# EAGLE design UCENGSOC_BadgeCore (EAGLE 9.6.2)
CNAME: UC ENG SOC Badge Core; CREVISION: 1.0; DESIGNER: Jed Hodson - Scatter Labs Pty Ltd

## Sheet 1 of 2: MCU Core
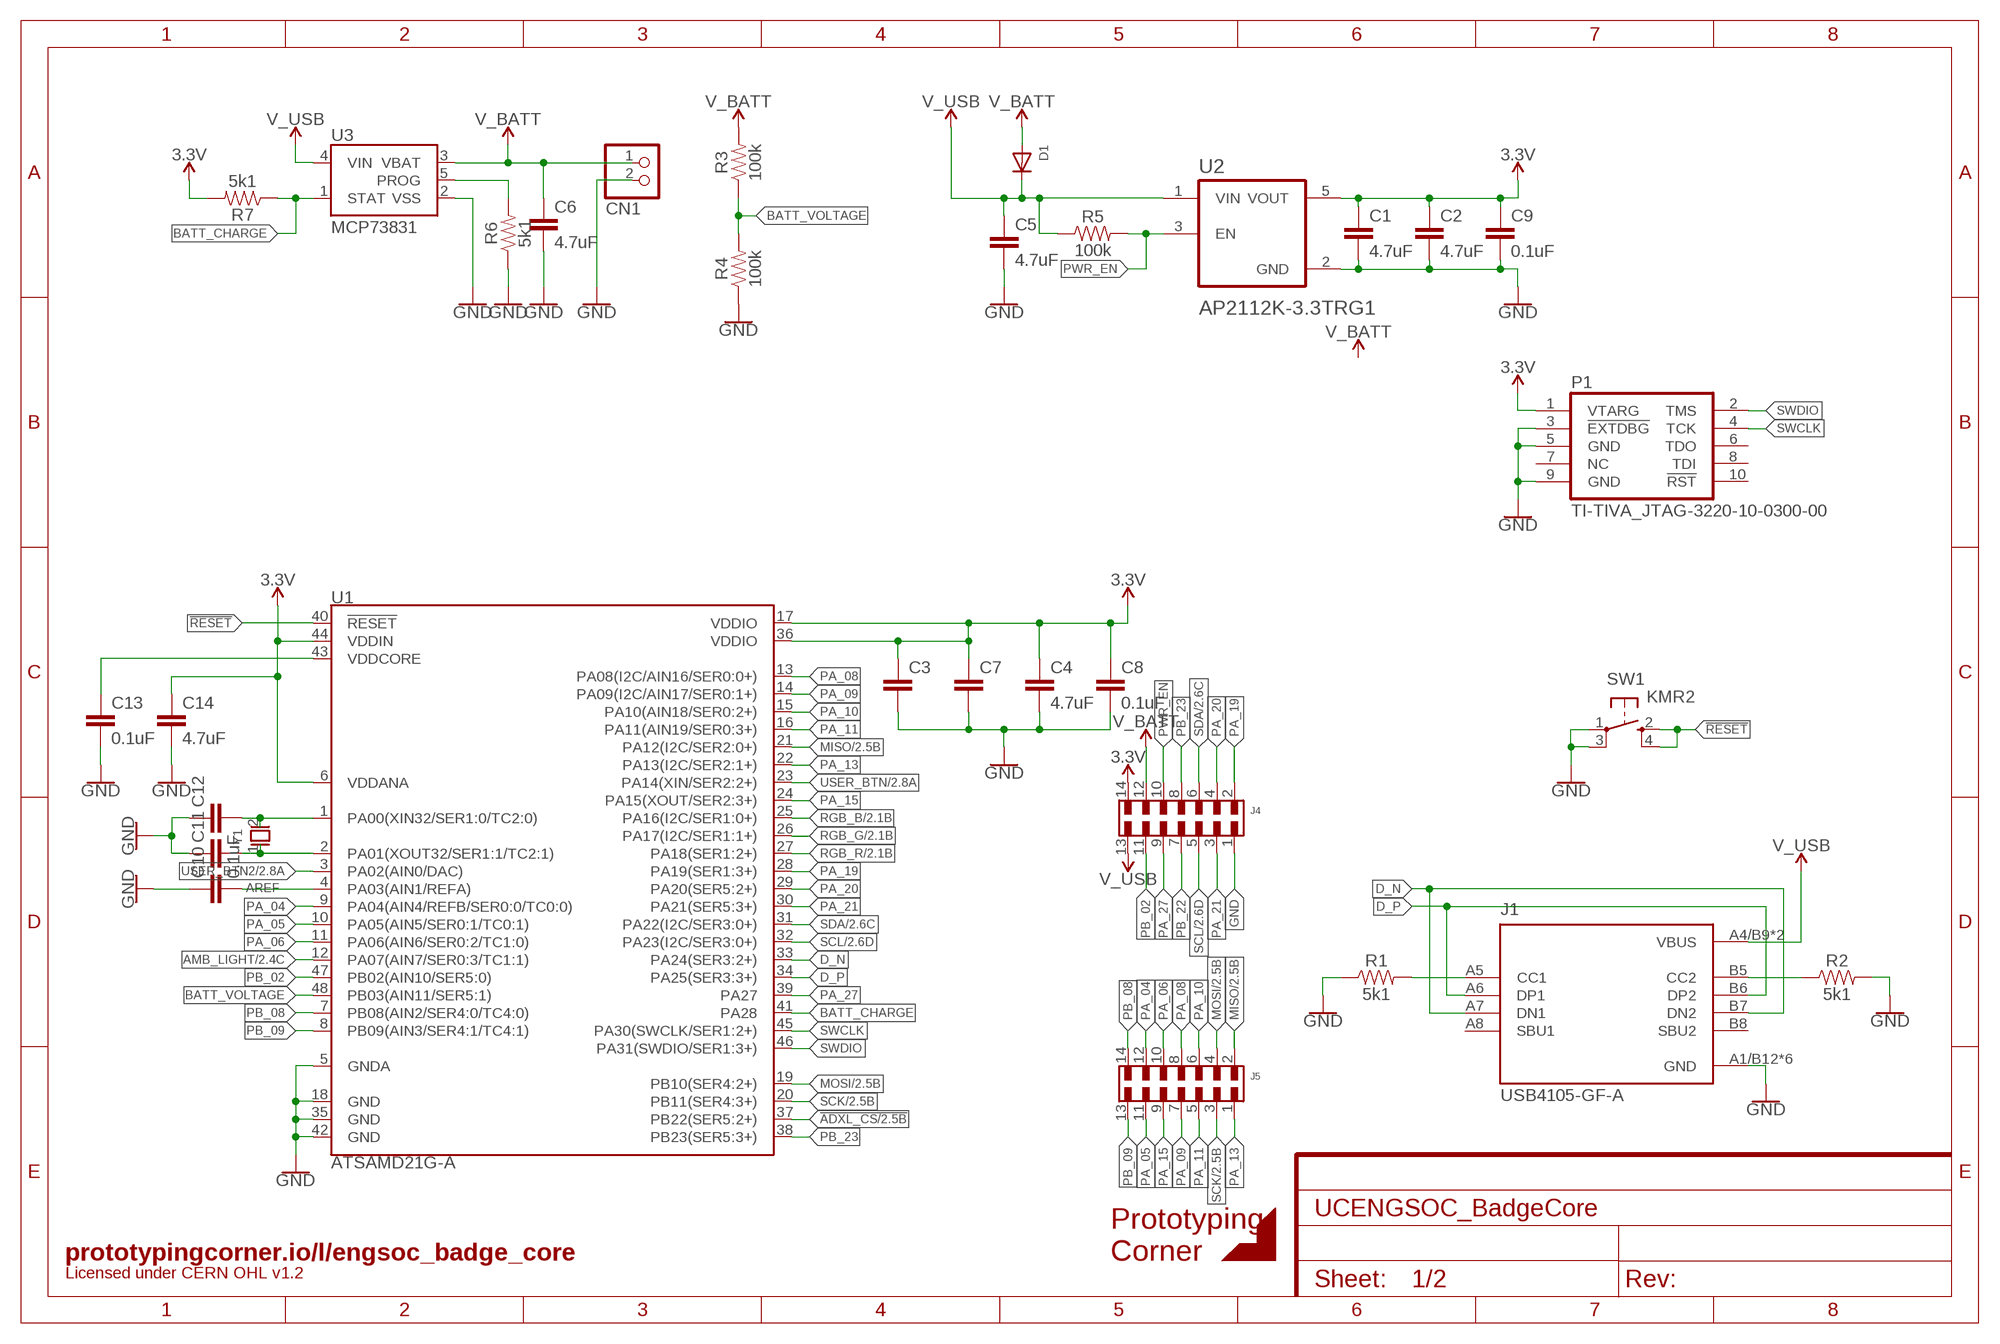
[diagram p0: schematic, sheet 1]

### Parts
C1  4.7uF  4.7UF-1206-16V-(+80/-20%)  [1206]
C2  4.7uF  4.7UF-1206-16V-(+80/-20%)  [1206]
C3  4.7UF-1206-16V-(+80/-20%)  [1206]
C4  4.7uF  4.7UF-1206-16V-(+80/-20%)  [1206]
C5  4.7uF  4.7UF-1206-16V-(+80/-20%)  [1206]
C6  4.7uF  4.7UF-1206-16V-(+80/-20%)  [1206]
C7  0.1UF-0603-25V-5%  [0603]
C8  0.1uF  0.1UF-0603-25V-5%  [0603]
C9  0.1uF  0.1UF-0603-25V-5%  [0603]
C10  0.1uF  0.1UF-0603-25V-5%  [0603]
C11  15PF-0603-50V-5%  [0603]
C12  15PF-0603-50V-5%  [0603]
C13  0.1uF  0.1UF-0603-25V-5%  [0603]
C14  4.7uF  4.7UF-1206-16V-(+80/-20%)  [1206]
CN1  JST_2PIN-SMT-RA  [JST-PH-2-SMT-RA]
D1  DIODE_SOD-123FL  [SOD-123FL]
J1  USB4105-GF-A  [GCT_USB4105-GF-A]
J4  6100XX21121_61001421121  [61001421121]
J5  6100XX21121_61001421121  [61001421121]
P1  TI-TIVA_JTAG-3220-10-0300-00  [TI-TIVA_3220-10-0300-00]
R1  5k1  RESISTOR0603  [0603]
R2  5k1  RESISTOR0603  [0603]
R3  100k  RESISTOR0603  [0603]
R4  100k  RESISTOR0603  [0603]
R5  100k  RESISTOR0603  [0603]
R6  5k1  RESISTOR0603  [0603]
R7  5k1  RESISTOR0603  [0603]
SW1  KMR2  SPST_TACT-KMR2  [KMR2]
U1  ATSAMD21G-A  [TQFP-48]
U2  AP2112K-3.3TRG1  [SOT95P285X140-5N]
U3  MCP73831  [SOT23-5]
U$1  LOGOSMALL_COPPER  [LOGO_SMALL_COPPER]
Y1  FC-135_32.7680KA-A0  [XTAL_FC-135_32.7680KA-A0]

### Nets
3.3V: C1.1 C2.1 C3.1 C4.1 C7.1 C8.1 C9.1 C14.1 J4.14 P1.1(VTARG) R7.2 U1.6(VDDANA) U1.17(VDDIO) U1.36(VDDIO) U1.44(VDDIN) U2.5(VOUT) ; also sheet 2
!ADXL_CS: U1.37(PB22(SER5:2+)) ; also sheet 2
!RESET: SW1.2(S) SW1.4(S1) U1.40(!RESET!)
AMB_LIGHT: U1.12(PA07(AIN7/SER0:3/TC1:1)) ; also sheet 2
AREF: C10.2 U1.4(PA03(AIN1/REFA))
BATT_CHARGE: R7.1 U1.41(PA28) U3.1(STAT)
BATT_VOLTAGE: R3.1 R4.2 U1.48(PB03(AIN11/SER5:1))
D_N: J1.A7(DN1) J1.B7(DN2) U1.33(PA24(SER3:2+))
D_P: J1.A6(DP1) J1.B6(DP2) U1.34(PA25(SER3:3+))
GND: C1.2 C2.2 C3.2 C4.2 C5.2 C6.2 C7.2 C8.2 C9.2 C10.1 C11.1 C12.1 C13.2 C14.2 CN1.2 J1.A1/B12(GND) J1.B1/A12(GND) J1.G1(GND) J1.G2(GND) J1.G3(GND) J1.G4(GND) J4.1 P1.3(!EXTDBG!) P1.5(GND) P1.9(GND) R1.1 R2.2 R4.1 R6.1 SW1.1(P) SW1.3(P1) U1.5(GNDA) U1.18(GND) U1.35(GND) U1.42(GND) U2.2(GND) U3.2(VSS) ; also sheet 2
MISO: J5.2 U1.21(PA12(I2C/SER2:0+)) ; also sheet 2
MOSI: J5.4 U1.19(PB10(SER4:2+)) ; also sheet 2
N$1: R6.2 U3.5(PROG)
N$2: C13.1 U1.43(VDDCORE)
N$4: C12.2 U1.1(PA00(XIN32/SER1:0/TC2:0)) Y1.2
N$5: C11.2 U1.2(PA01(XOUT32/SER1:1/TC2:1)) Y1.1
N$31: J1.A5(CC1) R1.2
N$34: J1.B5(CC2) R2.1
PA_04: J5.12 U1.9(PA04(AIN4/REFB/SER0:0/TC0:0))
PA_05: J5.11 U1.10(PA05(AIN5/SER0:1/TC0:1))
PA_06: J5.10 U1.11(PA06(AIN6/SER0:2/TC1:0))
PA_08: J5.8 U1.13(PA08(I2C/AIN16/SER0:0+))
PA_09: J5.7 U1.14(PA09(I2C/AIN17/SER0:1+))
PA_10: J5.6 U1.15(PA10(AIN18/SER0:2+))
PA_11: J5.5 U1.16(PA11(AIN19/SER0:3+))
PA_13: J5.1 U1.22(PA13(I2C/SER2:1+))
PA_15: J5.9 U1.24(PA15(XOUT/SER2:3+))
PA_19: J4.2 U1.28(PA19(SER1:3+))
PA_20: J4.4 U1.29(PA20(SER5:2+))
PA_21: J4.3 U1.30(PA21(SER5:3+))
PA_27: J4.9 U1.39(PA27)
PB_02: J4.11 U1.47(PB02(AIN10/SER5:0))
PB_08: J5.14 U1.7(PB08(AIN2/SER4:0/TC4:0))
PB_09: J5.13 U1.8(PB09(AIN3/SER4:1/TC4:1))
PB_22: J4.7
PB_23: J4.8 U1.38(PB23(SER5:3+))
PWR_EN: J4.10 R5.2 U2.3(EN)
RGB_B: U1.25(PA16(I2C/SER1:0+)) ; also sheet 2
RGB_G: U1.26(PA17(I2C/SER1:1+)) ; also sheet 2
RGB_R: U1.27(PA18(SER1:2+)) ; also sheet 2
SCK: J5.3 U1.20(PB11(SER4:3+)) ; also sheet 2
SCL: J4.5 U1.32(PA23(I2C/SER3:0+)) ; also sheet 2
SDA: J4.6 U1.31(PA22(I2C/SER3:0+)) ; also sheet 2
SWCLK: P1.4(TCK) U1.45(PA30(SWCLK/SER1:2+))
SWDIO: P1.2(TMS) U1.46(PA31(SWDIO/SER1:3+))
USER_BTN: U1.23(PA14(XIN/SER2:2+)) ; also sheet 2
USER_BTN2: U1.3(PA02(AIN0/DAC)) ; also sheet 2
V_BATT: C6.1 CN1.1 D1.A J4.12 R3.2 U3.3(VBAT)
V_USB: C5.1 D1.C J1.A4/B9(VBUS) J1.B4/A9(VBUS) J4.13 R5.1 U2.1(VIN) U3.4(VIN)
Unconnected: J1.A8(SBU1) J1.B8(SBU2) P1.6(TDO) P1.7(NC) P1.8(TDI) P1.10(!RST!)

### Notes on the sheet
- prototypingcorner.io/l/engsoc_badge_core
- Licensed under CERN OHL v1.2

## Sheet 2 of 2: Peripherals
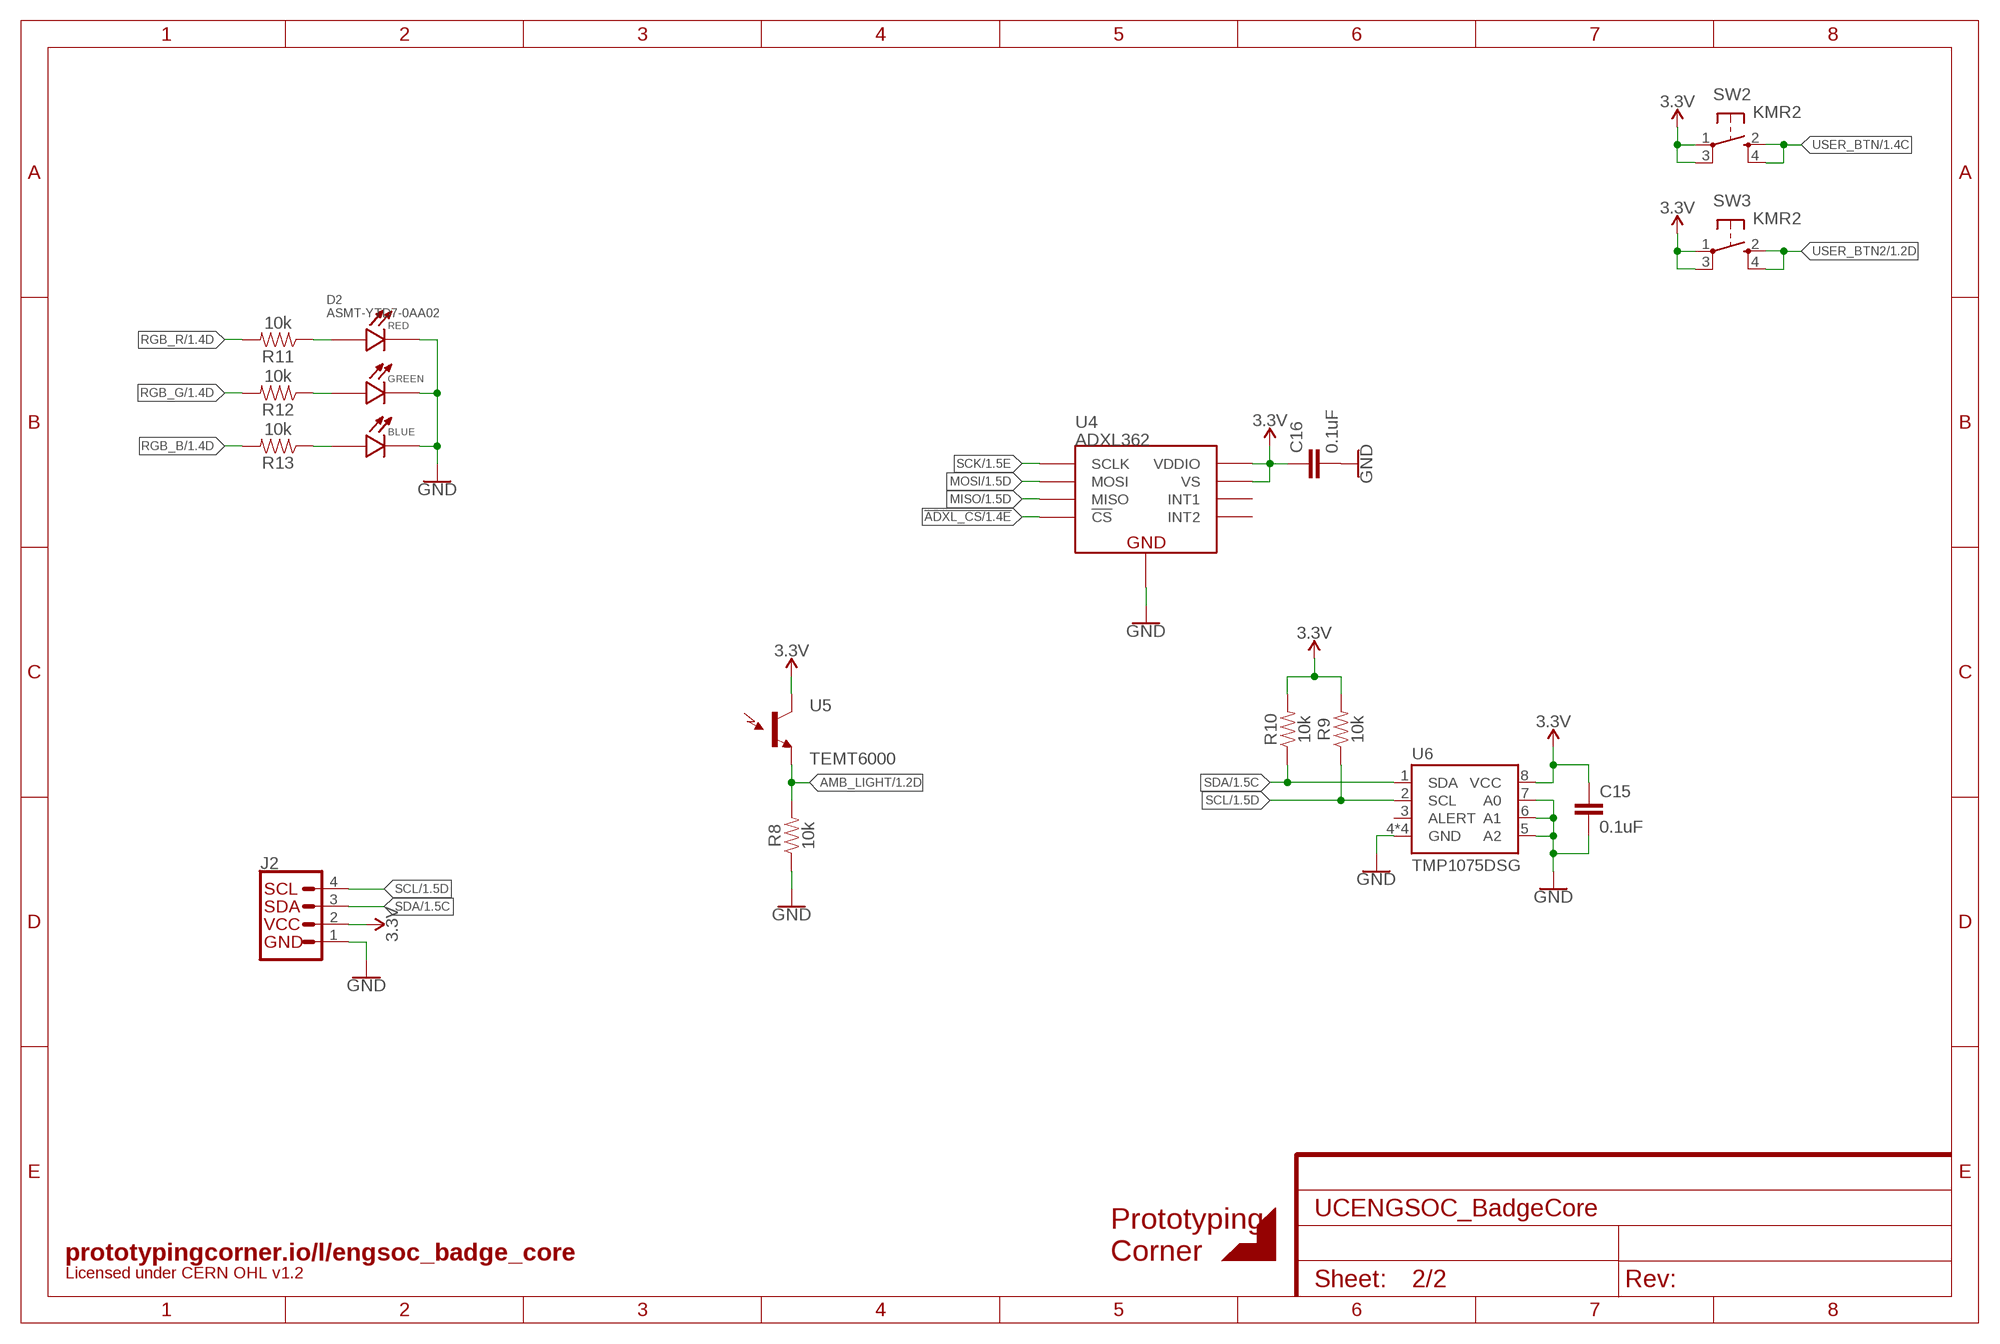
[diagram p1: schematic, sheet 2]

### Parts
C15  0.1uF  0.1UF-0603-25V-(+80/-20%)  [0603]
C16  0.1uF  0.1UF-0603-25V-(+80/-20%)  [0603]
D2  ASMT-YTD7-0AA02  [LED_ASMT-YTD7-0AA02]
J2  QWIIC_CONNECTORJS-1MM  [1X04_1MM_RA]
R8  10k  10KOHM-0603-1/10W-1%  [0603]
R9  10k  10KOHM-0603-1/10W-1%  [0603]
R10  10k  10KOHM-0603-1/10W-1%  [0603]
R11  10k  10KOHM-0603-1/10W-1%  [0603]
R12  10k  10KOHM-0603-1/10W-1%  [0603]
R13  10k  10KOHM-0603-1/10W-1%  [0603]
SW2  KMR2  SPST_TACT-KMR2  [KMR2]
SW3  KMR2  SPST_TACT-KMR2  [KMR2]
U4  ADXL362  [ADXL362]
U5  TEMT6000  [TEMT6000-SEN]
U6  TMP1075DSG  [WSON8]
U$2  LOGOSMALL_COPPER  [LOGO_SMALL_COPPER]

### Nets
3.3V: C15.1 C16.1 J2.2(VCC) R9.2 R10.2 SW2.1(P) SW2.3(P1) SW3.1(P) SW3.3(P1) U4.P$1(VDDIO) U4.P$14(VS) U5.COLLECTOR(C1) U6.8(VCC) ; also sheet 1
!ADXL_CS: U4.P$8(!CS) ; also sheet 1
AMB_LIGHT: R8.2 U5.EMITTER(E1) ; also sheet 1
GND: C15.2 C16.2 D2.1(B_C) D2.2(G_C) D2.3(R_C) J2.1(GND) R8.1 U4.P$12(GND) U4.P$13(GND) U4.P$16(GND) U6.4(GND) U6.5(A2) U6.6(A1) U6.7(A0) U6.9(GND) U6.10(GND) U6.11(GND) ; also sheet 1
MISO: U4.P$7(MISO) ; also sheet 1
MOSI: U4.P$6(MOSI) ; also sheet 1
N$11: D2.6(B_A) R13.1
N$12: D2.5(G_A) R12.1
N$13: D2.4(R_A) R11.1
RGB_B: R13.2 ; also sheet 1
RGB_G: R12.2 ; also sheet 1
RGB_R: R11.2 ; also sheet 1
SCK: U4.P$4(SCLK) ; also sheet 1
SCL: J2.4(SCL) R9.1 U6.2(SCL) ; also sheet 1
SDA: J2.3(SDA) R10.1 U6.1(SDA) ; also sheet 1
USER_BTN: SW2.2(S) SW2.4(S1) ; also sheet 1
USER_BTN2: SW3.2(S) SW3.4(S1) ; also sheet 1
Unconnected: U4.P$9(INT2) U4.P$11(INT1) U6.3(ALERT)

### Notes on the sheet
- prototypingcorner.io/l/engsoc_badge_core
- Licensed under CERN OHL v1.2

## Library data of the parts
C1 C2 C4-C6 C14 = SparkFun-Capacitors:4.7UF: 4.7µF ceramic capacitors A capacitor is a passive two-terminal electrical component used to store electrical energy temporarily in an electric field.; PROD_ID: CAP-10300
C3 = SparkFun-Capacitors:4.7UF: 4.7µF ceramic capacitors A capacitor is a passive two-terminal electrical component used to store electrical energy temporarily in an electric field.; PROD_ID: CAP-10300; VALUE: 4.7uF
C7 = SparkFun-Capacitors:0.1UF: 0.1µF ceramic capacitors A capacitor is a passive two-terminal electrical component used to store electrical energy temporarily in an electric field.; PROD_ID: CAP-08604; VALUE: 0.1uF
C8-C10 C13 = SparkFun-Capacitors:0.1UF: 0.1µF ceramic capacitors A capacitor is a passive two-terminal electrical component used to store electrical energy temporarily in an electric field.; PROD_ID: CAP-08604
C11 C12 = SparkFun-Capacitors:15PF: 15pF ceramic capacitors A capacitor is a passive two-terminal electrical component used to store electrical energy temporarily in an electric field.; PROD_ID: CAP-07881; VALUE: 15pF
C15 C16 = SparkFun-Capacitors:0.1UF: 0.1µF ceramic capacitors A capacitor is a passive two-terminal electrical component used to store electrical energy temporarily in an electric field.; PROD_ID: CAP-00810
CN1 = adafruit:JST_2PIN: JST 2-Pin Connectors of various flavors SMT-RA (S2B-PH-SM4) 4UConnector #17311 SMT (B2B-PH-SM4) THM-RA (S2B-PH) THM (B2B-PH)
D1 = adafruit:DIODE: Diode SMADIODE - SMA Surface Mount Package 20V 1A Schottky Diode Digikey: 641-1014-6-ND DO-1N4148 - Through Hole Small Current Diode SOD-123 20V 1 A (.5mV Vf) Schottky Diode - Digikey: MBRX120TPMSCT-ND SOD-323 10V 570mA (.38mV Vf, 3ns) Schottky Diode - Digikey: ZLLS410CT-ND SOD-523 30V 30mA Schottky Diode (RB751S-40TE61) - Digikey: RB751S-40TE61CT-ND SOT23-R/W - SOT23 Package (R = Solder Paste/Reflow Ovens, W = Hand-Soldering) BAT54Film 40V 300mA - Digikey: 497-7162-1-ND
D2 = ASMT-YTD7-0AA02:ASMT-YTD7-0AA02: SMD LED RGB 1.8...3.6 V PLCC-6 | Broadcom ASMTYTD70AA02 @ LED, SMD (SMD LED RGB 1.8...3.6 V PLCC-6 LEDs – SMD).; AVAILABILITY: Unavailable; DESCRIPTION: Red, Green, Blue _RGB_ 623nm Red, 529nm Green, 469nm Blue LED Indication - Discrete 2.1V Red, 3.1V Green, 3.1V Blue 6-SMD, J-Lead; MF: Broadcom Limited; MP: ASMT-YTD7-0AA02; PACKAGE: PLCC-6 Broadcom; PRICE: None
J1 = USB4105-GF-A:USB4105-GF-A: USB Type C Receptacle for USB 2.0 SMT Type, PCB Top Mount; AVAILABILITY: Unavailable; DESCRIPTION: USB-C _USB TYPE-C_ USB 2.0 Receptacle Connector 24 _16+8 Dummy_ Position Surface Mount, Right Angle; Through Hole; MF: GCT; MP: USB4105-GF-A; PACKAGE: None; PRICE: None
J2 = SparkFun-Connectors:QWIIC_CONNECTOR: SparkFun I2C Standard Qwiic Connector An SMD 1mm pitch JST connector makes it easy and quick (get it? Qwiic?) to connect I2C devices to each other. The Qwiic system <http://www.sparkfun.com/qwiic> enables fast and solderless connection between popular platforms and various sensors and actuators. We carry 200mm <https://www.sparkfun.com/products/14204>, 100mm <https://www.sparkfun.com/products/14205>, 50mm <https://www.sparkfun.com/products/14206>, and breadboard friendly <https://www.sparkfun.com/products/14207> Qwiic cables. We also offer 10 pcs strips <https://www.sparkfun.com/products/14323> the SMD connectors.
J4 J5 = Wurth_Connectors_WR-PHD:6100XX21121_61001421121: WR-PHD 2.54 mm SMT Dual Pin Header ARTICLE PROPERTIES: Pins:4;​ 6;​ 8;​ 10;​ 12;​ 14;​ 16;​ 20;​ 22;​ 24;​ 26;​ 32;​ 34;​ 36 KIND PROPERTIES: Pitch：2.54 mm Quality Class:3 as per CECC 75 301-802 Rows：Dual Gender：Pin Header Type：Straight MATERIAL PROPERTIES: Insulator Material :PA6T Insulator Flammability Rating:UL94 V-0 Contact Material:Copper Alloy Contact Plating:Gold Contact Type:Stamped GENERAL INFORMATION Operating Temperature:-40 up to +125 °C Compliance:Lead free / RoHS ELECTRICAL PROPERTIES: Rated Current:3 A IR 1:3 A Withstanding Voltage:500 V (AC) Contact Resistance:20 mΩ RISO:1000 MΩ CERTIFICATION UL Approval:E323964 PACKAGING PROPERTIES Packaging:Tube Details see: https://katalog.we-online.com/en/em/PHD_2_54_SMT_DUAL_PIN_HEADER_6100XX21121 Updated by Yingchun,Shan 2019-10-18 2019 (C) Würth Elektronik; DATASHEET-URL: https://katalog.we-online.com/em/datasheet/61001421121.pdf; GENDER: Pin Header; IR: 3A; MATES: WR-PHD 2.54mm Angled DualSocket Header/Dual Socket Header/Dual Socket Header Bottom Entry/Dual Socket Header Bottom Entry Large/SMT Dual Socket Header/SMT Dual Socket Header Bottom Entry; PACKAGING: Tube; PART-NUMBER: 61001421121; PINS: 14; ROWS: Dual; TYPE: Straight
P1 = LinkedLibrary52101:TI-TIVA_JTAG-: JTAG HEADER 10-PIN
R1-R7 = SparkFun-Resistors:RESISTOR: Generic Resistor Package
R8-R13 = SparkFun-Resistors:10KOHM: 10kΩ resistor A resistor is a passive two-terminal electrical component that implements electrical resistance as a circuit element. Resistors act to reduce current flow, and, at the same time, act to lower voltage levels within circuits. - Wikipedia; PROD_ID: RES-00824
SW1-SW3 = adafruit:SPST_TACT: SMT 6mm switch, EVQQ2 series http://www.ladyada.net/library/eagle
U1 = SparkFun-IC-Microcontroller:ATSAMD21G: Atmel SAMD21G SMART ARM-Based Microcontroller The Atmel ® | SMART ™ SAM D21 is a series of low-power microcontrollers using the 32-bit ARM ® Cortex ® -M0+ processor, and ranging from 32- to 64-pins with up to 256KB Flash and 32KB of SRAM. The SAM D21 devices operate at a maximum frequency of 48MHz and reach 2.46 CoreMark/MHz. They are designed for simple and intuitive migration with identical peripheral modules, hex compatible code, identical linear address map and pin compatible migration paths between all devices in the product series. All devices include intelligent and flexible peripherals, Atmel Event System for inter-peripheral signaling, and support for capacitive touch button, slider and wheel user interfaces. Datasheet SparkFun Products SparkFun SAMD21 Mini Breakout (DEV-13664) SparkFun SAMD21 Dev Breakout (DEV-13672); PROD_ID: IC-13064
U2 = AP2112K-3.3TRG1:AP2112K-3.3TRG1: AP2112 Series 0.6 A 3.3 V Fixed Output SMT LDO Linear Regulator - SOT23-5; DESCRIPTION: AP2112 Series 0.6 A 3.3 V Fixed Output SMT LDO Linear Regulator - SOT23-5; DIGI-KEY_PART_NUMBER: AP2112K-3.3TRG1DICT-ND; DIGI-KEY_PURCHASE_URL: https://www.digikey.com.au/product-detail/en/diodes-incorporated/AP2112K-3.3TRG1/AP2112K-3.3TRG1DICT-ND/4505257?utm_source=snapeda&utm_medium=aggregator&utm_campaign=symbol; MF: Diodes Inc.; MP: AP2112K-3.3TRG1; PACKAGE: SOT-753 Diodes Inc.
U3 = SparkFun-IC-Power:MCP73831: MCP73831T Li-Ion, Li-Pol Controller Miniature single cell, fully integrated Li-Ion, Li-polymer charge management controller Datasheet <http://ww1.microchip.com/downloads/en/DeviceDoc/20001984g.pdf> SparkFun Products: SparkFun ESP32 Thing <https://www.sparkfun.com/products/13907> SparkFun 9DoF Razor IMU M0 <https://www.sparkfun.com/products/14001>; PROD_ID: IC-09995
U4 = SparkFun-Sensors:ADXL362: Micropower 3-axis accelerometer 2/4/8g digital output (SPI)
U5 = SparkFun:TEMT6000: Ambient Light Sensor Simple light detection sensor. Output varies with light intensity input. Spark Fun Electronics SKU : COM-08348
U6 = SecureBits_Electronics:TMP1075: TMP1075 Temperature Sensor With I 2C and SMBus Interface The TMP1075 is the most accurate and lowest power replacement to the industry standard LM75 and TMP75 digital temperature sensors. Available in SOIC-8 and VSSOP-8 packages, the TMP1075 offers pin-to-pin and software compatibility to quickly upgrade any existing xx75 design. An additional new package with the TMP1075 is 2x2 mm DFN reducing the PCB footprint by 79% compared to an SOIC package. Datasheet: https://www.ti.com/lit/ds/symlink/tmp1075.pdf?ts=1609996801486&ref_url=https%253A%252F%252Fwww.ti.com%252Fproduct%252FTMP1075
U$1 U$2 = PrototypingCorner-EagleLib:LOGO: Prototyping Corner Logos
Y1 = FC-135_32.7680KA-A0:FC-135_32.7680KA-A0: None; DESCRIPTION: 32.7680 Khz 20ppm 12.5pf; DIGI-KEY_PART_NUMBER: SER4077CT-ND; DIGI-KEY_PURCHASE_URL: https://www.digikey.com.au/product-detail/en/epson/FC-135-32.7680KA-A0/SER4077CT-ND/5604233?utm_source=snapeda&utm_medium=aggregator&utm_campaign=symbol; MF: EPSON; MP: FC-135 32.7680KA-A0; PACKAGE: SMD-2 Epson

## Board
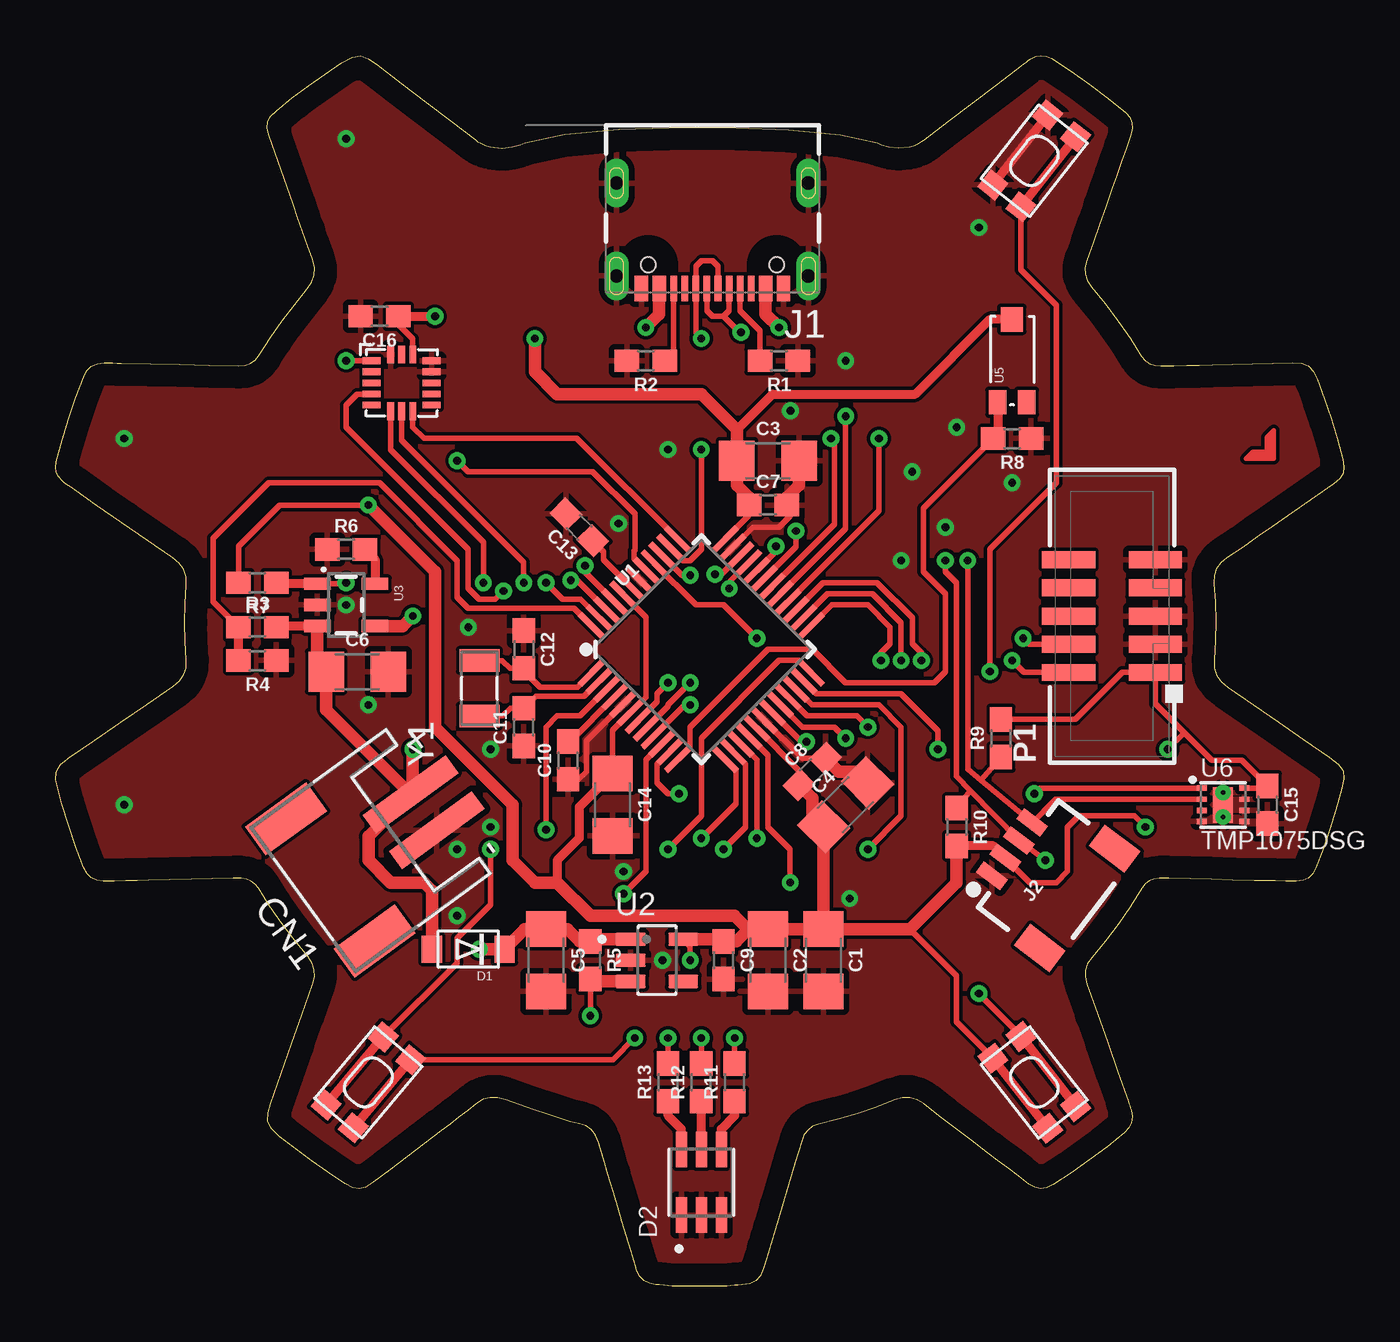
[diagram p2: board, top side]
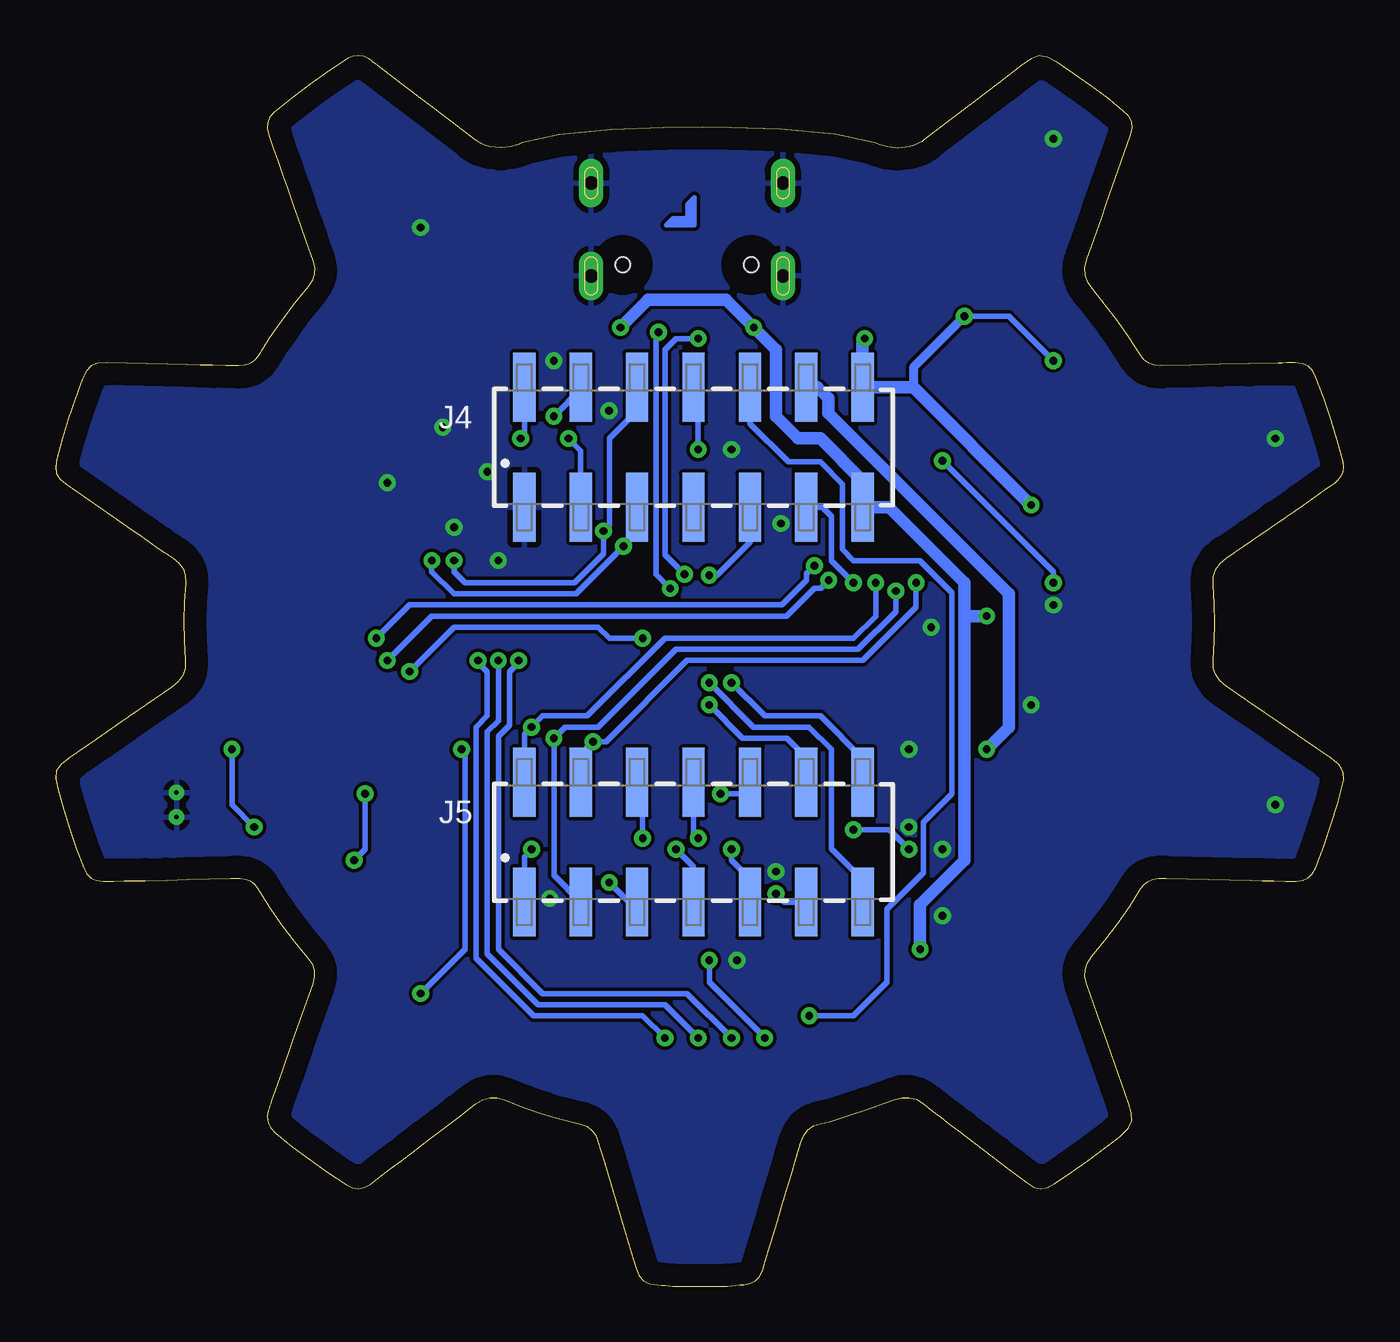
[diagram p3: board, bottom side, seen from below]

Size 58.05 x 55.42 mm. Coordinates in mm from the lower left corner, seen from the top.
Outline: 381 segments
Copper layers (1*16): Top 0.035mm / dielectric 1.5mm / Bottom 0.035mm
Design rules "default *": minimum track width 6mil, minimum drill 0.35mm, track to track 6mil, track to pad 6mil, pad to pad 6mil, via to via 6mil, smd to smd 6mil, copper to edge 40mil, drill to drill 6mil, minimum pad ring 10mil, minimum via ring 8mil, stop-mask expansion 4mil, vias tented up to drill 20mil, thermal gap 10mil

### Footprints (pad centres in the part's own frame; a part is rotated, then mirrored left to right if it is on the bottom)
1206 = smd 1.6 x 1.8: 1 -1.4,0; 2 1.4,0
0603 = smd 1.1 x 1: 1 -0.85,0; 2 0.85,0
JST-PH-2-SMT-RA = smd 1 x 4.6: 1 1,-3.7; 2 -1,-3.7 | smd 1.6 x 3.4: NC1 -3.4,1.5; NC2 3.4,1.5
SOD-123FL = smd 0.91 x 1.22: A 1.637,0; C -1.637,0
LED_ASMT-YTD7-0AA02 = smd 1.6 x 0.5: 1 -1.475,0.9; 2 -1.475,0; 3 -1.475,-0.9; 4 1.475,-0.9; 5 1.475,0; 6 1.475,0.9
GCT_USB4105-GF-A = smd 0.6 x 1.15: A1/B12 -3.2,4.755; A4/B9 -2.4,4.755; B1/A12 3.2,4.755; B4/A9 2.4,4.755 | smd 0.3 x 1.15: A5 -1.25,4.755; A6 -0.25,4.755; A7 0.25,4.755; A8 1.25,4.755; B5 1.75,4.755; B6 0.75,4.755; B7 -0.75,4.755; B8 -1.75,4.755 | drill 0.6 pad 1 long: G1 -4.32,0; G2 4.32,0 | drill 0.6 pad 1.05 long: G3 -4.32,4.18; G4 4.32,4.18 | hole 0.65: 2.89,3.68; -2.89,3.68
1X04_1MM_RA = smd 0.6 x 1.35: 1 -1.5,0; 2 -0.5,0; 3 0.5,0; 4 1.5,0 | smd 1.2 x 2: NC1 2.8,-3.675; NC2 -2.8,-3.675
61001421121 = smd 1 x 3.1: 1 -7.62,-2.7; 2 -7.62,2.7; 3 -5.08,-2.7; 4 -5.08,2.7; 5 -2.54,-2.7; 6 -2.54,2.7; 7 0,-2.7; 8 0,2.7; 9 2.54,-2.7; 10 2.54,2.7; 11 5.08,-2.7; 12 5.08,2.7; 13 7.62,-2.7; 14 7.62,2.7
TI-TIVA_3220-10-0300-00 = smd 0.76 x 2.4: 1 -2.54,-1.95; 2 -2.54,1.95; 3 -1.27,-1.95; 4 -1.27,1.95; 5 0,-1.95; 6 0,1.95; 7 1.27,-1.95; 8 1.27,1.95; 9 2.54,-1.95; 10 2.54,1.95
KMR2 = smd 1 x 1: 1 2,0.8; 2 2,-0.8; 3 -2,0.8; 4 -2,-0.8
TQFP-48 = smd 1.5 x 0.28: 1 -4.25,2.75; 2 -4.25,2.25; 3 -4.25,1.75; 4 -4.25,1.25; 5 -4.25,0.75; 6 -4.25,0.25; 7 -4.25,-0.25; 8 -4.25,-0.75; 9 -4.25,-1.25; 10 -4.25,-1.75; 11 -4.25,-2.25; 12 -4.25,-2.75; 25 4.25,-2.75; 26 4.25,-2.25; 27 4.25,-1.75; 28 4.25,-1.25; 29 4.25,-0.75; 30 4.25,-0.25; 31 4.25,0.25; 32 4.25,0.75; 33 4.25,1.25; 34 4.25,1.75; 35 4.25,2.25; 36 4.25,2.75 | smd 0.28 x 1.5: 13 -2.75,-4.25; 14 -2.25,-4.25; 15 -1.75,-4.25; 16 -1.25,-4.25; 17 -0.75,-4.25; 18 -0.25,-4.25; 19 0.25,-4.25; 20 0.75,-4.25; 21 1.25,-4.25; 22 1.75,-4.25; 23 2.25,-4.25; 24 2.75,-4.25; 37 2.75,4.25; 38 2.25,4.25; 39 1.75,4.25; 40 1.25,4.25; 41 0.75,4.25; 42 0.25,4.25; 43 -0.25,4.25; 44 -0.75,4.25; 45 -1.25,4.25; 46 -1.75,4.25; 47 -2.25,4.25; 48 -2.75,4.25
SOT95P285X140-5N = smd 1.35 x 0.6: 1 -1.185,0.95; 2 -1.185,0; 3 -1.185,-0.95; 4 1.185,-0.95; 5 1.185,0.95
SOT23-5 = smd 0.55 x 1.2: 1 -0.95,-1.3; 2 0,-1.3; 3 0.95,-1.3; 4 0.95,1.3; 5 -0.95,1.3
ADXL362 = smd 0.8 x 0.3: P$1 -1.35,1; P$2 -1.35,0.5; P$3 -1.35,0; P$4 -1.35,-0.5; P$5 -1.35,-1; P$9 1.35,-1; P$10 1.35,-0.5; P$11 1.35,0; P$12 1.35,0.5; P$13 1.35,1 | smd 0.3 x 0.8: P$6 -0.5,-1.275; P$7 0,-1.275; P$8 0.5,-1.275; P$14 0.5,1.275; P$15 0,1.275; P$16 -0.5,1.275
TEMT6000-SEN = smd 1.1 x 0.8: BASE -1.87,-0.65; EMITTER -1.87,0.65 | smd 1.1 x 1: COLLECTOR 1.86,0.01
WSON8 = smd 0.5 x 0.25: 1 -0.95,0.75; 2 -0.95,0.25; 3 -0.95,-0.25; 4 -0.95,-0.75; 5 0.95,-0.75; 6 0.95,-0.25; 7 0.95,0.25; 8 0.95,0.75 | smd 0.9 x 1.6: 9 0,0 | drill 0.2 pad 0.254: 10 0,0.55; 11 0,-0.55
XTAL_FC-135_32.7680KA-A0 = smd 1 x 1.8: 1 -1.25,0; 2 1.25,0

### Placement (x,y rotation side)
C1  34.6,14.68 270 top
C2  32.1,14.68 270 top
C3  32.1,37.18 0 top
C4  35.6,21.68 45 top
C5  22.1,14.68 270 top
C6  13.6,27.68 0 top
C7  32.1,35.18 0 top
C8  34.1,23.18 45 top
C9  30.1,14.68 270 top
C10  23.1,23.68 90 top
C11  21.1,25.18 90 top
C12  21.1,28.68 270 top
C13  23.6,34.18 135 top
C14  25.1,21.68 270 top
C15  54.6,21.68 270 top
C16  14.6,43.68 180 top
CN1  13.6,19.18 126 top
D1  18.6,15.18 180 top
D2  29.1,4.68 90 top
J1  29.6,49.68 180 top
J2  43.1,19.68 53 top
J4  29.31,37.78 0 bottom
J5  29.31,20 0 bottom
P1  47.6,30.18 90 top
R1  32.6,41.68 180 top
R2  26.6,41.68 180 top
R3  9.1,29.68 0 top
R4  9.1,28.18 180 top
R5  24.1,14.68 270 top
R6  13.1,33.18 0 top
R7  9.1,31.68 180 top
R8  43.1,38.18 180 top
R9  42.6,24.68 90 top
R10  40.6,20.68 270 top
R11  30.6,9.18 90 top
R12  29.1,9.18 90 top
R13  27.6,9.18 90 top
SW1  44.1,50.68 52 top
SW2  44.1,9.18 128 top
SW3  14.1,9.18 230 top
U1  29.1,28.68 45 top
U2  27.1,14.68 0 top
U3  13.1,30.68 270 top
U4  15.6,40.68 0 top
U5  43.1,41.68 90 top
U6  52.6,21.68 0 top
U$1  29.59,48.09 0 bottom
U$2  54.57,37.59 0 top
Y1  19.1,26.93 90 top

### Tracks (layer width: path | path; a pad name or v marks a point on that pad's centre or on a via)
3.3V  (via drill 0.35)
  Top 0.254: C7.1 31.23,35.2 31.23,34.7 U1.36 | U1.44 26.6,30.12 26.6,26.53 U1.6 25.1,25.03 C14.1 | U1.17 33.49,23.22 C8.1 | U6.8 54.5,22.43 C15.1 53.45,23.68 52.1,23.68 50.85,24.93 | R9.2 45.95,25.53 48.06,27.64 P1.1 49.55,26.23 50.85,24.93 | SW2.1 40.6,11.9 40.6,13.98 38.5,16.08 | J2.2 43.9,18.18 45.1,18.18 45.6,18.68 45.6,20.68 46.1,21.18 48.6,21.18 v49.1,20.68 | v50.1,24.18 50.85,24.93 | SW3.3 25.11,10.2 v26.1,11.18 | v28.6,14.68 28.6,15.31 U2.5 | R7.2 8.25,33.33 10.1,35.18 v14.1,35.18 | U4.P$14 16.1,42.68 15.45,43.33 C16.1 15.45,43.53 | U4.P$1 v13.1,41.68
  Top 0.406: J2.2 42.25,19.83 R10.2 | SW2.3 SW2.1 | SW3.1 SW3.3 | U5.COLLECTOR 42.1,43.54 38.74,40.18 32.3,40.18 30.7,38.58 | C16.1 v17.1,43.68 | C14.1 23.6,21.58 23.6,20.18 22.6,19.18 22.6,18.18
  Top 0.559: U2.5 30,15.63 C9.1 30.68,15.53 31.23,16.08 C2.1 | C2.1 C1.1 | C8.1 34.1,21.98 34.1,21.18 34.59,20.69 C4.1 C1.1 | C1.1 38.5,16.08 40.6,18.18 R10.2 | C7.1 31.25,35.53 30.7,36.08 C3.1 30.7,38.58 29.1,40.18 22.6,40.18 21.6,41.18 v21.6,42.68 | C2.1 31.2,16.08 30.6,16.68 24.1,16.68 22.6,18.18 21.6,18.18 20.6,19.18 20.6,21.68 17.1,25.18 17.1,32.18 v14.1,35.18
  Bottom 0.254: v49.1,20.68 50.1,21.68 v50.1,24.18 | v26.1,11.18 28.6,13.68 v28.6,14.68 | v13.1,41.68 15.1,43.68 v17.1,43.68
  Bottom 0.406: v17.1,43.68 19.4,41.38 19.4,40.48
  Bottom 0.559: v14.1,35.18 19.4,40.48 J4.14 21.69,42.59 v21.6,42.68
!ADXL_CS
  Top 0.254: U1.37 23.48,38.18 16.6,38.18 16.1,38.68 U4.P$8
!RESET  (via drill 0.35)
  Top 0.254: U1.40 28.86,30.68 30.1,30.68 v31.6,29.18 | v42.1,27.68 42.1,33.18 45.1,36.18 45.1,44.18 43.49,45.78 SW1.4
  Top 0.406: SW1.2 SW1.4
  Bottom 0.254: v31.6,29.18 33.1,29.18 33.6,29.68 40.1,29.68 v42.1,27.68
AMB_LIGHT
  Top 0.254: U1.12 28.6,24.29 28.6,25.18 32.1,28.68 34.1,28.68 35.6,27.18 39.6,27.18 40.1,27.68 40.1,31.18 39.1,32.18 39.1,35.03 R8.2
  Top 0.406: U5.EMITTER 42.45,38.38 R8.2
AREF
  Top 0.254: U1.4 23.18,24.53 C10.2
BATT_CHARGE  (via drill 0.35)
  Top 0.254: v18.1,37.18 18.6,36.68 24.2,36.68 26.1,34.78 26.1,33.15 26.07,33.12 26.07,32.77 U1.41 | v13.1,31.68 13.05,31.63 11.6,31.63
  Top 0.406: U3.1 11.6,31.63 10,31.63 R7.1
  Bottom 0.254: v18.1,37.18 13.1,32.18 v13.1,31.68
BATT_VOLTAGE
  Top 0.254: U1.48 23.36,30.53 18.6,30.53 18.1,31.03 18.1,32.68 14.6,36.18 9.6,36.18 7.1,33.68 7.1,30.83 R3.1
  Top 0.406: R4.2 R3.1
D_N  (via drill 0.35)
  Top 0.254: J1.B7 30.35,43.93 30.1,43.68 | 30.1,43.68 29.6,43.68 29.35,43.93 J1.A7 | U1.33 30.33,31.68 30.33,31.45 v30.36,31.42 | v30.88,42.96 30.81,42.96 30.1,43.68
  Bottom 0.254: v30.36,31.42 31,32.06 31,42.84 v30.88,42.96
D_P  (via drill 0.35)
  Top 0.254: J1.A6 29.85,45.93 29.6,46.18 29.1,46.18 28.85,45.93 J1.B6 28.85,42.93 v29.1,42.68 | U1.34 29.97,32.03 29.74,32.03 v29.71,32.06
  Bottom 0.254: v29.71,32.06 30.6,32.94 30.6,42.18 30.1,42.68 v29.1,42.68
GND  (via drill 0.35)
  Top 0.254: U1.18 33.64,23.78 C8.2 | 30.75,33.51 U1.35 31.41,34.18 32.6,34.18 33.1,34.68 33.1,35.03 C7.2 | U1.5 23.92,24.56 23.92,23.18 23.57,22.83 C10.1
  Top 0.406: SW1.1 SW1.3
  Top 0.559: C7.2 32.95,35.53 33.5,36.08 C3.2 | C8.2 35.3,23.18 36.08,23.18 C4.2
  other vias: 27.34,14.68 27.6,37.68 18.1,19.68 19.6,20.68 18.6,29.68 3.1,21.68 3.1,38.18 13.1,51.68 38.1,32.68 13.1,30.68 33.12,39.43 19.6,24.18 43.1,36.18 40.1,34.18 38.6,36.68 40.6,38.68 35.6,41.68 41.6,47.68 35.78,17.46 25.37,34.35 14.1,26.18 18.1,16.68 25.6,18.68
  pour Top: 0.1,-0.32 58.6,-0.32 58.6,42.68 58.6,55.68 4.1,55.68 0.1,55.68
  pour Bottom: 0.1,-0.32 58.6,-0.32 58.6,55.68 0.1,55.68
MISO  (via drill 0.35)
  Top 0.254: U1.21 33.86,25.68 36.1,25.68 v36.6,25.18 | v21.1,31.68 21.1,32.59 15.6,38.09 U4.P$7
  Bottom 0.254: J5.2 36.93,24.85 v36.6,25.18 36.1,25.68 34.1,25.68 30.6,29.18 22.1,29.18 21.1,30.18 v21.1,31.68
MOSI  (via drill 0.35)
  Top 0.254: U1.19 33.61,24.52 v33.83,24.52 | v19.28,31.68 19.28,33.5 15.1,37.68 U4.P$6
  Bottom 0.254: J5.4 34.39,23.97 v33.83,24.52 33.25,24.52 29.6,28.18 21.68,28.18 19.28,30.58 v19.28,31.68
N$1
  Top 0.406: R6.2 14.4,32.73 U3.5
N$2
  Top 0.254: U1.43 24.7,32.72 24.7,33.08 C13.1
N$4
  Top 0.254: Y1.2 20.13,28.18 20.48,27.83 C12.2 21.1,27.72 21.83,26.98 23.51,26.98 U1.1
N$5
  Top 0.254: Y1.1 20.14,25.68 20.49,26.03 C11.2 21.64,26.58 23.81,26.58 U1.2
N$11
  Top 0.406: D2.6 28.2,7.08 27.6,7.68 R13.1
N$12
  Top 0.406: D2.5 R12.1
N$13
  Top 0.406: D2.4 30,7.08 30.6,7.68 R11.1
N$31
  Top 0.254: J1.A5 30.85,43.93 31.75,43.03 R1.2
N$34
  Top 0.254: J1.B5 27.85,42.08 R2.1
PA_04  (via drill 0.35)
  Top 0.254: v28.6,26.18 28.36,26.18 U1.9
  Bottom 0.254: v28.6,26.18 27.1,24.68 25.1,24.68 24.23,23.81 J5.12
PA_05  (via drill 0.35)
  Top 0.254: U1.10 26.6,23.7 26.6,19.18 26.6,18.68 v25.6,17.68
  Bottom 0.254: v25.6,17.68 25.22,17.3 J5.11
PA_06  (via drill 0.35)
  Top 0.254: U1.11 27.1,23.5 27.1,22.68 27.6,22.18 v28.1,22.18
  Bottom 0.254: v28.1,22.18 26.6,22.18 26.6,22.53 J5.10
PA_08  (via drill 0.35)
  Top 0.254: U1.13 30.66,23.23 30.66,21.73 v29.11,20.18 v29.1,20.18
  Bottom 0.254: J5.8 29.31,20.39 v29.1,20.18
PA_09  (via drill 0.35)
  Top 0.254: U1.14 31.1,23.5 31.1,20.68 v30.1,19.68
  Bottom 0.254: v30.1,19.68 29.31,18.89 J5.7
PA_10  (via drill 0.35)
  Top 0.254: U1.15 31.6,23.7 v31.6,20.18
  Bottom 0.254: v31.6,20.18 31.6,22.45 J5.6
PA_11  (via drill 0.35)
  Top 0.254: U1.16 32.1,23.91 32.1,20.68 33.1,19.68 v33.1,18.18
  Bottom 0.254: v33.1,18.18 32.22,17.3 J5.5
PA_13  (via drill 0.35)
  Top 0.254: U1.22 34.07,26.18 37.1,26.18 38.1,25.18 38.1,21.18 v36.6,19.68
  Bottom 0.254: v36.6,19.68 36.93,19.35 J5.1
PA_15  (via drill 0.35)
  Top 0.254: U1.24 33.48,28.18 32.6,28.18 29.1,24.68 29.1,21.18 v27.6,19.68
  Bottom 0.254: v27.6,19.68 27.6,19.18 26.77,18.35 J5.9
PA_19  (via drill 0.35)
  Top 0.254: U1.28 37.1,34.91 v37.1,38.18
  Bottom 0.254: v37.1,38.18 36.93,38.35 J4.2
PA_20  (via drill 0.35)
  Top 0.254: U1.29 35.6,34.12 v35.6,39.18
  Bottom 0.254: v35.6,39.18 34.39,40.39 J4.4
PA_21  (via drill 0.35)
  Top 0.254: U1.30 35.1,34.33 35.1,38.02 v34.94,38.18
  Bottom 0.254: v34.94,38.18 34.39,37.63 J4.3
PA_27  (via drill 0.35)
  Top 0.254: U1.39 28.23,32.02 v28.6,32.02
  Bottom 0.254: v28.6,32.02 28.25,32.02 26.77,33.51 J4.9
PB_02  (via drill 0.35)
  Top 0.254: U1.47 23.66,30.93 22.84,30.93 v22.1,31.68
  Bottom 0.254: J4.11 23.5,35.08 23.1,34.68 23.1,32.68 v22.1,31.68
PB_08  (via drill 0.35)
  Top 0.254: U1.7 27.1,26.33 27.1,26.68 v27.6,27.18
  Bottom 0.254: v27.6,27.18 26.1,25.68 23.6,25.68 21.69,23.77 J5.14
PB_09  (via drill 0.35)
  Top 0.254: U1.8 27.6,26.12 27.6,26.18 v28.6,27.18
  Bottom 0.254: v28.6,27.18 26.6,25.18 24.1,25.18 23.1,24.18 23.1,19.71 21.69,18.3 J5.13
PB_23  (via drill 0.35)
  Top 0.254: U1.38 28.28,32.68 28.6,32.68 29.1,33.18 v29.1,37.68
  Bottom 0.254: v29.1,37.68 29.1,40.27 J4.8
PWR_EN  (via drill 0.35)
  Top 0.254: v24.1,12.18 24.1,13.63 24.2,13.73
  Top 0.559: U2.3 24.2,13.73 R5.2
  Bottom 0.254: J4.10 26.77,38.85 25.04,37.12 23.6,37.12 22.6,36.12 22.6,33.18 22.1,32.68 19.1,32.68 17.65,31.24 17.65,22.18 18.94,20.9 18.94,18.63 20.6,16.97 20.6,13.68 22.1,12.18 v24.1,12.18
RGB_B  (via drill 0.35)
  Top 0.254: R13.2 v27.6,11.18 | U1.25 34.98,30.68 36.6,30.68 37.6,29.68 37.6,28.93 37.19,28.52 v37.19,28.18
  Bottom 0.254: v37.19,28.18 37.19,28.09 37.6,27.68 37.6,25.27 38.1,24.77 38.1,15.18 36.1,13.18 29.6,13.18 v27.6,11.18
RGB_G  (via drill 0.35)
  Top 0.254: R12.2 v29.1,11.18 | U1.26 34.78,31.18 36.8,31.18 38.1,29.89 v38.1,28.18
  Bottom 0.254: v38.1,28.18 38.1,25.47 38.6,24.97 38.6,14.97 36.3,12.68 30.6,12.68 v29.1,11.18
RGB_R  (via drill 0.35)
  Top 0.254: R11.2 v30.6,11.18 | U1.27 34.57,31.68 37.01,31.68 38.6,30.09 38.6,28.93 39,28.52 v39,28.18
  Bottom 0.254: v39,28.18 39,28.09 38.6,27.68 38.6,25.68 39.1,25.18 39.1,14.77 36.51,12.18 31.6,12.18 v30.6,11.18
SCK  (via drill 0.35)
  Top 0.254: U1.20 33.66,25.18 35.1,25.18 v35.6,24.68 | U4.P$4 13.6,40.18 13.1,39.68 13.1,38.68 18.6,33.18 18.6,31.43 19.09,30.93 19.81,30.93 v20.19,31.31
  Bottom 0.254: J5.3 35.6,18.51 v35.6,24.68 35.1,25.18 33.6,25.18 30.1,28.68 21.89,28.68 20.19,30.38 v20.19,31.31
SCL  (via drill 0.35)
  Top 0.254: U6.2 45.05,21.93 J2.4 41.69,22.79 | U1.32 32.45,33.1 v32.45,33.32 | 41.69,22.79 41.1,23.29 v41.1,32.68 | R9.1 41.69,22.79
  Bottom 0.254: J4.5 31.85,33.93 v32.45,33.32 34.6,31.18 39.6,31.18 39.8,31.18 40.1,31.18 41.1,32.18 v41.1,32.68
SDA  (via drill 0.35)
  Top 0.254: U6.1 44.35,22.43 v44.1,22.18 | v44.6,19.18 J2.3 41.23,22.31 | U1.31 33.35,33.29 v33.35,34.01 | 41.23,22.31 40.6,22.96 40.6,31.68 40.1,32.18 v40.1,32.68 | R10.1 41.23,22.31
  Bottom 0.254: v44.1,22.18 44.1,19.68 v44.6,19.18 | J4.6 31.85,39.43 33.1,38.18 33.1,34.27 v33.35,34.01 33.35,32.99 34.67,31.68 39.6,31.68 40.1,32.18 v40.1,32.68
SWCLK  (via drill 0.35)
  Top 0.254: U1.45 23.86,32.15 v23.86,32.44 | P1.4 43.87,28.91 v43.6,29.18
  Bottom 0.254: v23.86,32.44 24.21,32.08 24.21,31.8 25.33,30.68 42.1,30.68 v43.6,29.18
SWDIO  (via drill 0.35)
  Top 0.254: U1.46 23.5,31.8 v23.21,31.8 | P1.2 43.64,27.64 v43.1,28.18
  Bottom 0.254: v23.21,31.8 23.57,31.44 23.86,31.44 25.12,30.18 41.1,30.18 v43.1,28.18
USER_BTN  (via drill 0.35)
  Top 0.254: U1.23 34.28,26.68 38.1,26.68 39.6,25.18 39.75,25.02 v39.75,24.18 | SW2.2 43.49,11.28 v41.6,13.18
  Top 0.406: SW2.4 43.49,11.28
  Bottom 0.254: v39.75,24.18 39.6,24.02 39.6,15.18 v41.6,13.18
USER_BTN2  (via drill 0.35)
  Top 0.254: U1.3 23.62,25.68 22.6,25.68 22.1,25.18 v22.1,20.56 | SW3.4 18.1,14.55 18.1,15.68 19.6,17.18 v19.6,19.68
  Top 0.406: SW3.2 SW3.4
  Bottom 0.254: v22.1,20.56 20.48,20.56 v19.6,19.68
V_BATT  (via drill 0.35)
  Top 0.406: U3.3 10,29.73 R3.2
  Top 0.559: U3.3 11.8,28.08 C6.1 12.2,25.97 CN1.1 | CN1.1 14.1,20.26 14.1,19.18 15.1,18.18 16.6,18.18 16.96,17.82 D1.A | v16.1,24.18 16.1,22.26 CN1.1
  Bottom 0.559: J4.12 23.73,40.48 23.23,39.98 23.23,39.31 15.1,31.18 15.1,25.18 v16.1,24.18
V_USB  (via drill 0.35)
  Top 0.559: U2.1 24.2,15.63 R5.1 23.62,15.53 23.07,16.08 C5.1 21.13,16.08 D1.C v19.1,15.18 | J1.A4/B9 32,43.78 v32.6,43.18 | U3.4 15.65,29.73 v16.1,30.18 | J1.B4/A9 27.2,43.78 v26.6,43.18
  Bottom 0.559: v32.6,43.18 31.35,44.43 27.85,44.43 v26.6,43.18 25.6,42.18 25.6,39.18 24.6,38.18 23.6,38.18 21.69,36.27 J4.13 20.5,35.08 17.1,31.68 17.1,30.18 | 17.1,30.18 17.1,19.18 19.1,17.18 v19.1,15.18 | v16.1,30.18 17.1,30.18